# EAGLE schematic FrigoTemp (EAGLE 9.5.1)
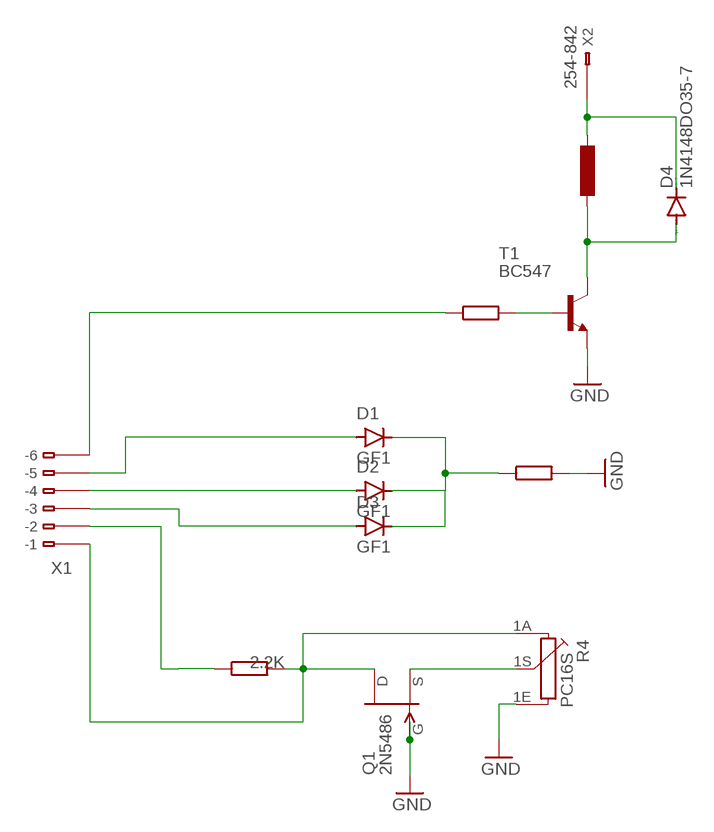
[diagram p0: schematic, sheet 1]
R3 (R): R: 2.2K

## Parts
D1  GF1  [SMA-DO214AC]
D2  GF1  [SMA-DO214AC]
D3  GF1  [SMA-DO214AC]
D4  1N4148DO35-7  [DO35-7]
Q1  2N5486  [TO92-]
R4  PC16S  [PC16S]
T1  BC547  [TO92]
X1  233-106  [233-106]
X2  254-842  [254-842]

## Nets
GND: Q1.1(G) R4.1E T1.1(E)
N$1: D1.A X1.B5(B-5)
N$2: D2.A X1.B4(B-4)
N$3: D3.A X1.B3(B-3)
N$4: D1.K(C) D2.K(C) D3.K(C)
N$5: D4.A T1.3(C)
N$6: D4.C X2.1@2(B1)
N$7: T1.2(B)
N$9: Q1.2(S) R4.1S
N$10: Q1.3(D) R4.1A X1.B1(B-1)
N$11: X1.B6(B-6)
N$12: X1.B2(B-2)
Unconnected: X1.A1(-1) X1.A2(-2) X1.A3(-3) X1.A4(-4) X1.A5(-5) X1.A6(-6) X2.1@1(A1)

## Library data of the parts
D1-D3 = diode:GF1: DIODE
D4 = diode:1N4148: DIODE high speed (Philips)
Q1 = transistor-fet:?548*: N-Channel JFETs Source: VISHAY 2N5484.pdf Compatible: TO92 2N5245 J304 J305 U310 J308 J309 J310 TO72 2N4416 2N4416A 2N3823 2N4351 3N169 3N170 3N171 MFE3002 TO18 2N3796 2N3797 MFE825 Source: Motorola European Master Guide Pacge 3-59
R4 = piher:PC16S: POTENTIOMETER single carbon potentiometer, 16 mm, S3ROH; OC_FARNELL: 4452940; OC_NEWARK: unknown
T1 = transistor:BC547: NPN TRANSISTOR
X1 = con-wago:233-106: WAGO Cage Clamp; MPN: 233-106; OC_FARNELL: unknown; OC_NEWARK: 28K9048
X2 = con-wago:254-84*: 1-Leiter-Einzelklemme für Leiterplatten 2 Lötstifte/Pol 1-polig Source: http://www.wagocatalog.com; OC_FARNELL: unknown; OC_NEWARK: unknown